# Altium schematic sheet signal1.SchDoc
size A4; SheetNumber: 1; SheetTotal: 6
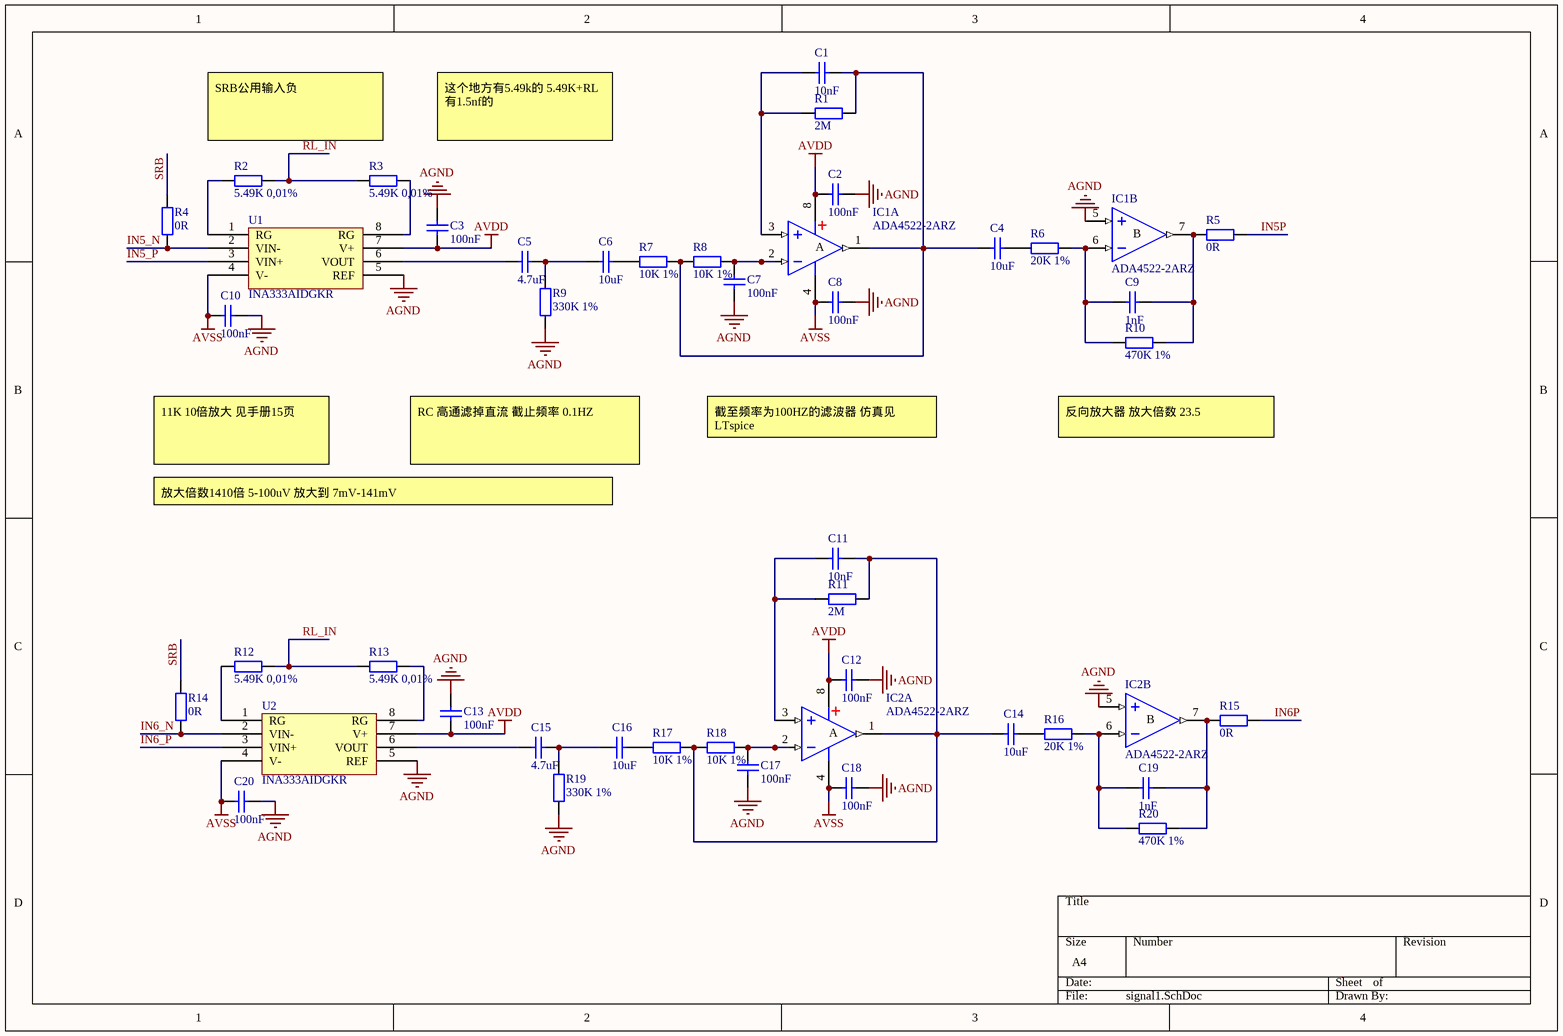
[diagram p0: signal1.SchDoc]

## Parts
C1  10nF  [C0603_L]
C2  100nF  [C0603_L]
C3  100nF  [C0603_L]
C4  10uF  [C0603_L]
C5  4.7uF  [C0603_L]
C6  10uF  [C0603_L]
C7  100nF  [C0603_L]
C8  100nF  [C0603_L]
C9  1nF  [C0603_L]
C10  100nF  [C0603_L]
C11  10nF  [C0603_L]
C12  100nF  [C0603_L]
C13  100nF  [C0603_L]
C14  10uF  [C0603_L]
C15  4.7uF  [C0603_L]
C16  10uF  [C0603_L]
C17  100nF  [C0603_L]
C18  100nF  [C0603_L]
C19  1nF  [C0603_L]
C20  100nF  [C0603_L]
IC1  ADA4522-2ARZ  [SOIC-8]  (parts A,B of 2)
IC2  ADA4522-2ARZ  [SOIC-8]  (parts A,B of 2)
R1  2M  [R0603_L]
R2  5.49K 0,01%  [R0603_M]
R3  5.49K 0,01%  [R0603_M]
R4  0R  [R0603_L]
R5  0R  [R0603_L]
R6  20K 1%  [R0603_L]
R7  10K 1%  [R0603_L]
R8  10K 1%  [R0603_L]
R9  330K 1%  [R0603_L]
R10  470K 1%  [R0603_L]
R11  2M  [R0603_L]
R12  5.49K 0,01%  [R0603_M]
R13  5.49K 0,01%  [R0603_M]
R14  0R  [R0603_L]
R15  0R  [R0603_L]
R16  20K 1%  [R0603_L]
R17  10K 1%  [R0603_L]
R18  10K 1%  [R0603_L]
R19  330K 1%  [R0603_L]
R20  470K 1%  [R0603_L]
U1  INA333AIDGKR  [MSOP8_N]
U2  INA333AIDGKR  [MSOP8_N]

## Nets
AGND: C2.2 C3.1 C7.1 C8.2 C10.1 C12.2 C13.1 C17.1 C18.2 C20.1 IC1.5(IN+) IC2.5(IN+) R9.1 R19.1 U1.5(REF) U2.5(REF)
AVDD: C2.1 C3.2 C12.1 C13.2 IC1.8(V+) IC2.8(V+) U1.7(V+) U2.7(V+)
AVSS: C8.1 C10.2 C18.1 C20.2 IC1.4(V-) IC2.4(V-) U1.4(V-) U2.4(V-)
IN5_N: R4.2 U1.2(VIN-)
IN5_P: U1.3(VIN+)
IN5P: R5.1
IN6_N: R14.2 U2.2(VIN-)
IN6_P: U2.3(VIN+)
IN6P: R15.1
RL_IN: R2.2 R3.1 R12.2 R13.1
SRB: R4.1 R14.1
NetC1_1: C1.1 IC1.3(IN+) R1.2
NetC1_2: C1.2 C4.1 IC1.1(OUT) R1.1 R7.1 R8.2
NetC4_2: C4.2 R6.2
NetC5_1: C5.1 U1.6(VOUT)
NetC5_2: C5.2 C6.1 R9.2
NetC6_2: C6.2 R7.2
NetC7_2: C7.2 IC1.2(IN-) R8.1
NetC9_1: C9.1 IC1.6(IN-) R6.1 R10.2
NetC9_2: C9.2 IC1.7(OUT) R5.2 R10.1
NetC11_1: C11.1 IC2.3(IN+) R11.2
NetC11_2: C11.2 C14.1 IC2.1(OUT) R11.1 R17.1 R18.2
NetC14_2: C14.2 R16.2
NetC15_1: C15.1 U2.6(VOUT)
NetC15_2: C15.2 C16.1 R19.2
NetC16_2: C16.2 R17.2
NetC17_2: C17.2 IC2.2(IN-) R18.1
NetC19_1: C19.1 IC2.6(IN-) R16.1 R20.2
NetC19_2: C19.2 IC2.7(OUT) R15.2 R20.1
NetR2_1: R2.1 U1.1(RG)
NetR3_2: R3.2 U1.8(RG)
NetR12_1: R12.1 U2.1(RG)
NetR13_2: R13.2 U2.8(RG)

## Notes on the sheet
- SRB公用输入负
- 这个地方有5.49k的 5.49K+RL 有1.5nf的
- 截至频率为100HZ的滤波器 仿真见LTspice
- 反向放大器 放大倍数 23.5
- 11K 10倍放大 见手册15页
- 放大倍数1410倍 5-100uV 放大到 7mV-141mV
- RC 高通滤掉直流 截止频率 0.1HZ
- (in symbol ADA4522-2ARZ, part A) A
- (in symbol ADA4522-2ARZ, part B) B

## Library data of the parts
C1-C20 = C: 贴片电容/MLCC电容; BOM名称: 无极性贴片电容; 联系下单店铺卖家 免费帮你查找封装: 联系下单店铺卖家 免费技术指导
IC1 IC2 = ADA4522-2ARZ: 双通道55V、EMI增强型、零漂移、超低噪声、RRO运算放大器; BOM名称: 双路运放; 封装库来自淘宝卖家：黄晶宝石: 其他店铺购入均为赃物，无售后更新权益，请立即申请退款，退款后现金奖励200~1000元; jlc_id: C403697
R1-R20 = R: 贴片电阻; 联系下单店铺卖家 免费帮你查找封装: 联系下单店铺卖家 免费技术指导; BOM名称: 贴片电阻
U1 U2 = INA333AIDGKR: INA333 低功耗、零漂移、精密仪表放大器; jlc_id: C19450